# Altium schematic sheet MCU_Main.SchDoc
size A4; SheetNumber: 5
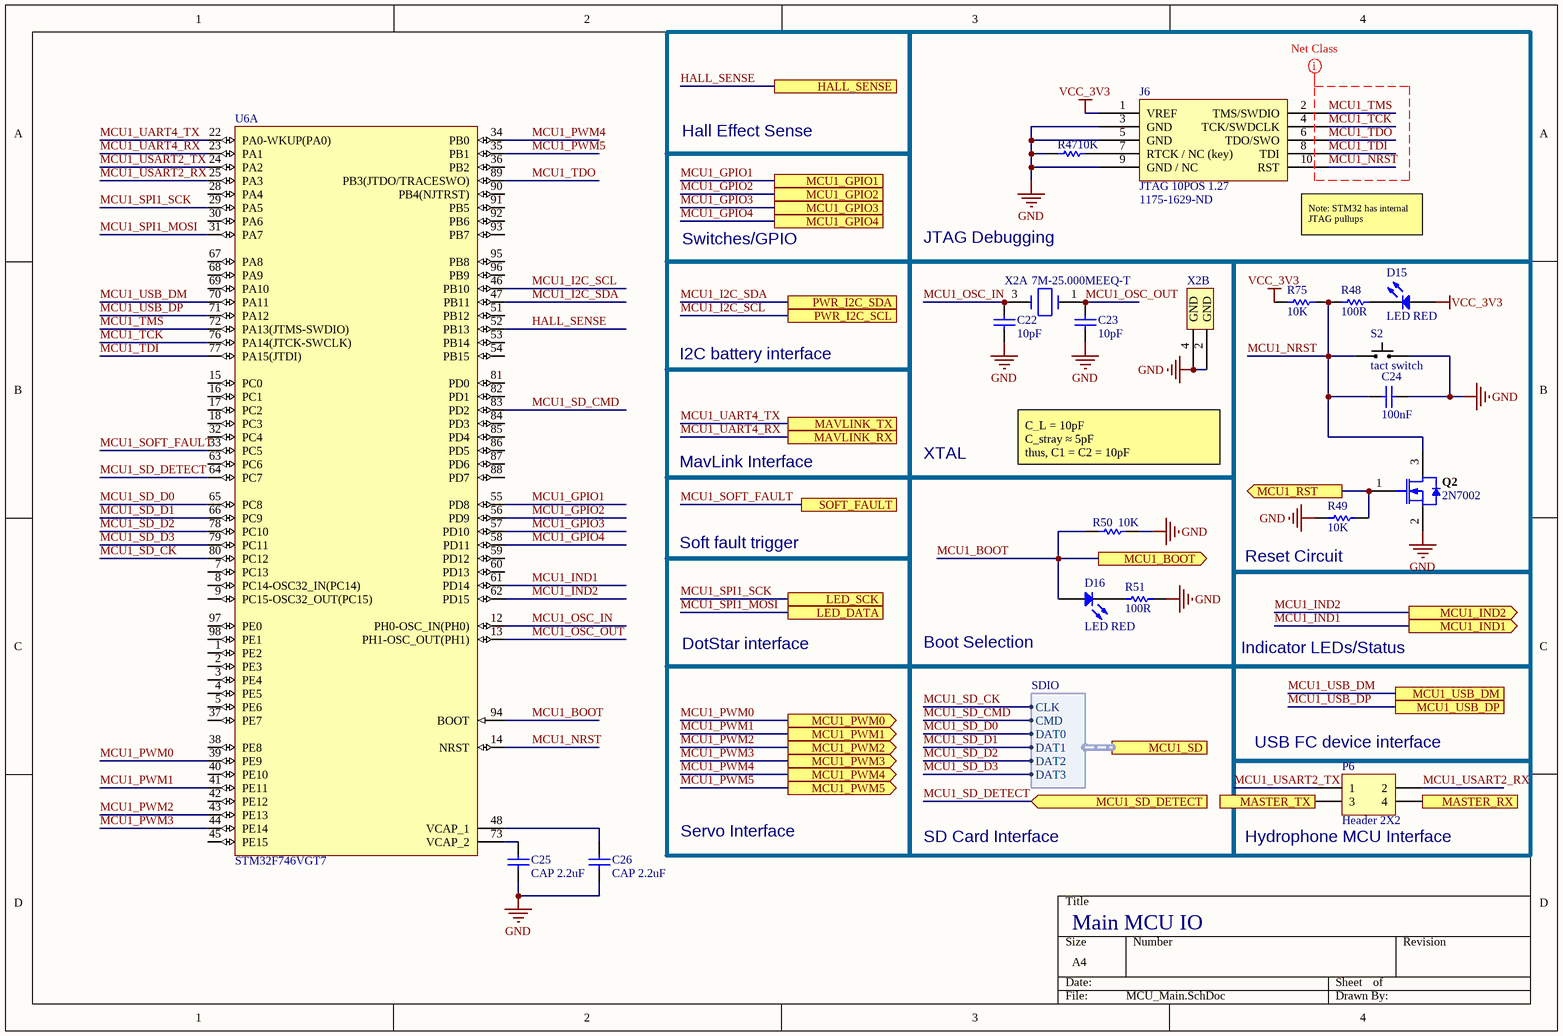
[diagram p0: MCU_Main.SchDoc]

## Parts
C22  10pF  [CAPC0603(1608)100_N]
C23  10pF  [CAPC0603(1608)100_N]
C24  100nF  [CAPC0603(1608)100_N]
C25  CAP 2.2uF  [CAPC0603(1608)100_N]
C26  CAP 2.2uF  [CAPC0603(1608)100_N]
D15  LED RED  [LED_0805]
D16  LED RED  [LED_0805]
J6  JTAG 10POS 1.27  Supplier Part Number 1: 1175-1629-ND  [5x2 JTAG SMD]
P6  Header 2X2  [HDR2X2]
Q2  2N7002  [INF-PG-SOT23_M]
R47  10K  [RESC0603(1608)_N]
R48  100R  [RESC0603(1608)_N]
R49  10K  [RESC0603(1608)_N]
R50  10K  [RESC0603(1608)_N]
R51  100R  [RESC0603(1608)_N]
R75  10K  [RESC0603(1608)_N]
S2  tact switch  [EVP-AA202K]
U6  STM32F746VGT7  [STM-LQFP100_L]  (part A of 2)
X2  7M-25.000MEEQ-T  [OSCSC320X250X100N]  (parts A,B of 2)

## Blocks framed on the sheet
JTAG Debugging: J6 R47
Reset Circuit: C24 D15 Q2 R48 R49 R75 S2

## Ports
HALL_SENSE, LED_DATA, LED_SCK, MASTER_RX, MASTER_TX, MAVLINK_RX, MAVLINK_TX, MCU1_BOOT (out), MCU1_GPIO1, MCU1_GPIO2, MCU1_GPIO3, MCU1_GPIO4, MCU1_IND1 (out), MCU1_IND2 (out), MCU1_PWM0 (out), MCU1_PWM1 (out), MCU1_PWM2 (out), MCU1_PWM3 (out), MCU1_PWM4 (out), MCU1_PWM5 (out), MCU1_RST (out), MCU1_SD (harness SDIO), MCU1_SD_DETECT (in), MCU1_USB_DM, MCU1_USB_DP, PWR_I2C_SCL, PWR_I2C_SDA, SOFT_FAULT

## Harnesses
SDIO: CLK, CMD, DAT0, DAT1, DAT2, DAT3

## Nets
GND: C22.1 C23.1 C24.1 C25.1 C26.1 J6.3(GND) J6.5(GND) J6.9(GND_/_NC) Q2.2(SOURCE) R47.1 R49.2 R50.2 R51.2 S2.2 X2.2(GND) X2.4(GND)
VCC_3V3: D15.2(A) J6.1(VREF) R75.2
HALL_SENSE: U6.52(PB13) ; port HALL_SENSE
MASTER_RX: P6.4 ; port MASTER_RX
MASTER_TX: P6.3 ; port MASTER_TX
MCU1_BOOT: D16.2(A) R50.1 U6.94(BOOT) ; port MCU1_BOOT
MCU1_GPIO1: U6.55(PD8) ; port MCU1_GPIO1
MCU1_GPIO2: U6.56(PD9) ; port MCU1_GPIO2
MCU1_GPIO3: U6.57(PD10) ; port MCU1_GPIO3
MCU1_GPIO4: U6.58(PD11) ; port MCU1_GPIO4
MCU1_I2C_SCL: U6.46(PB10) ; port PWR_I2C_SCL
MCU1_I2C_SDA: U6.47(PB11) ; port PWR_I2C_SDA
MCU1_IND1: U6.61(PD14) ; port MCU1_IND1
MCU1_IND2: U6.62(PD15) ; port MCU1_IND2
MCU1_NRST: C24.2 J6.10(RST) Q2.3(DRAIN) R48.2 R75.1 S2.1 U6.14(NRST)
MCU1_OSC_IN: C22.2 U6.12(PH0-OSC_IN(PH0)) X2.3
MCU1_OSC_OUT: C23.2 U6.13(PH1-OSC_OUT(PH1)) X2.1
MCU1_PWM0: U6.39(PE9) ; port MCU1_PWM0
MCU1_PWM1: U6.41(PE11) ; port MCU1_PWM1
MCU1_PWM2: U6.43(PE13) ; port MCU1_PWM2
MCU1_PWM3: U6.44(PE14) ; port MCU1_PWM3
MCU1_PWM4: U6.34(PB0) ; port MCU1_PWM4
MCU1_PWM5: U6.35(PB1) ; port MCU1_PWM5
MCU1_RST: Q2.1(GATE) R49.1 ; port MCU1_RST
MCU1_SD_CK: U6.80(PC12) ; port MCU1_SD.CLK
MCU1_SD_CMD: U6.83(PD2) ; port MCU1_SD.CMD
MCU1_SD_D0: U6.65(PC8) ; port MCU1_SD.DAT0
MCU1_SD_D1: U6.66(PC9) ; port MCU1_SD.DAT1
MCU1_SD_D2: U6.78(PC10) ; port MCU1_SD.DAT2
MCU1_SD_D3: U6.79(PC11) ; port MCU1_SD.DAT3
MCU1_SD_DETECT: U6.64(PC7) ; port MCU1_SD_DETECT
MCU1_SOFT_FAULT: U6.33(PC5) ; port SOFT_FAULT
MCU1_SPI1_MOSI: U6.31(PA7) ; port LED_DATA
MCU1_SPI1_SCK: U6.29(PA5) ; port LED_SCK
MCU1_TCK: J6.4(TCK/SWDCLK) U6.76(PA14(JTCK-SWCLK))
MCU1_TDI: J6.8(TDI) U6.77(PA15(JTDI))
MCU1_TDO: J6.6(TDO/SWO) U6.89(PB3(JTDO/TRACESWO))
MCU1_TMS: J6.2(TMS/SWDIO) U6.72(PA13(JTMS-SWDIO))
MCU1_UART4_RX: U6.23(PA1) ; port MAVLINK_RX
MCU1_UART4_TX: U6.22(PA0-WKUP(PA0)) ; port MAVLINK_TX
MCU1_USART2_RX: P6.2 U6.25(PA3)
MCU1_USART2_TX: P6.1 U6.24(PA2)
MCU1_USB_DM: U6.70(PA11) ; port MCU1_USB_DM
MCU1_USB_DP: U6.71(PA12) ; port MCU1_USB_DP
NetC25_2: C25.2 U6.73(VCAP_2)
NetC26_2: C26.2 U6.48(VCAP_1)
NetD15_1: D15.1(K) R48.1
NetD16_1: D16.1(K) R51.1
NetJ6_7: J6.7(RTCK_/_NC_(key)) R47.2

Not connected (* = marked no-connect by the designer): U6 1(PE2) 2(PE3) 3(PE4) 4(PE5) 5(PE6) 7(PC13) 8(PC14-OSC32_IN(PC14)) 9(PC15-OSC32_OUT(PC15)) 15(PC0) 16(PC1) 17(PC2) 18(PC3) 28(PA4) 30(PA6) 32(PC4) 36(PB2) 37(PE7) 38(PE8) 40(PE10) 42(PE12) 45(PE15) 51(PB12) 53(PB14) 54(PB15) 59(PD12) 60(PD13) 63(PC6) 67(PA8) 68(PA9) 69(PA10) 81(PD0) 82(PD1) 84(PD3) 85(PD4) 86(PD5) 87(PD6) 88(PD7) 90(PB4(NJTRST)) 91(PB5) 92(PB6) 93(PB7) 95(PB8) 96(PB9) 97(PE0) 98(PE1)

## Layout directives
net class JTAG: MCU1_NRST, MCU1_TCK, MCU1_TDI, MCU1_TDO, MCU1_TMS

## Notes on the sheet
- Hall Effect Sense
- Switches/GPIO
- (near J6) Note: STM32 has internal JTAG pullups
- I2C battery interface
- MavLink Interface
- XTAL
- C_L = 10pF
  C_stray ≈ 5pF
  thus, C1 = C2 = 10pF
- Soft fault trigger
- DotStar interface
- Boot Selection
- Indicator LEDs/Status
- (near P6) USB FC device interface
- Servo Interface
- SD Card Interface
- (near P6) Hydrophone MCU Interface
- Main MCU IO

## Library data of the parts
C22 C23 = CMP-1035-00549-1: CAP 10pF 25V ±1% 0603 (1608 Metric) Thickness 1mm SMD; Case-EIA: 0603; Case-Metric: 1608; Tolerance: Â±1%; Technology: SMT; Max Thickness: 1 mm; Value: 10pF; Rated Voltage: 25 V
C24 = CMP-1035-02580-1: CAP 100nF 10V ±10% 0603 (1608 Metric) Thickness 1mm SMD; Tolerance: Â±10%; Case-EIA: 0603; Case-Metric: 1608; Max Thickness: 1 mm; Value: 100nF; Rated Voltage: 10 V; Technology: SMT
C25 C26 = CMP-1035-02758-1: CAP 2.2uF 10V ±10% 0603 (1608 Metric) Thickness 1mm SMD; Case-EIA: 0603; Case-Metric: 1608; Tolerance: Â±10%; Rated Voltage: 10 V; Value: 2.2uF; Max Thickness: 1 mm; Technology: SMT
D15 D16 = LED0: led; Manufacturer: Lite-On Inc.; Manufacturer Part Number: LTST-C171KRKT; Lens Color: Colorless; Lens Transparency: Clear; Millicandela Rating: 54mcd; Lens Style/Size: Rectangle with Flat Top, 1.40mm x 1.25mm; Voltage - Forward (Vf) (Typ): 2V; Current - Test: 20mA; Viewing Angle: 130°; Wavelength - Dominant: 631nm; Wavelength - Peak: 639nm; Supplier 1: Digi-Key; Supplier Part Number 1: 160-1427-1-ND; RoHS: RoHS Compliant; Category: Optoelectronics; Stock 1: 260544; Pricing 1: 1=0.31, 10=0.225, 25=0.1656, 100=0.1183, 250=0.0804, 500=0.07096, 1000=0.05558 (USD); Packaging: Cut Tape (CT); Part Status: Active; Color: Red; Mounting Type: Surface Mount; Features: -; Package / Case: 0805 (2012 Metric); Size / Dimension: 2.00mm L x 1.25mm W; Height (Max): 0.80mm; ComponentLink1URL: http://optoelectronics.liteon.com/upload/download/DS22-2000-109/LTST-C171KRKT.pdf; ComponentLink1Description: http://optoelectronics.liteon.com/upload/download/DS22-2000-109/LTST-C171KRKT.pdf
J6 = jtag 10pos mini: Supplier 1: Digi-Key
P6 = Header 2X2: Header, 2-Pin, Dual row; LatestRevisionDate: 17-Jul-2002; LatestRevisionNote: Re-released for DXP Platform.; Publisher: Altium Limited
Q2 = CMP-1149-00026-1: N-Channel OptiMOS Small-Signal-Transistor, 60 V VDS, 0.3 A ID, -55 to 150 degC, PG-SOT23, Reel, Green; Manufacturer: Infineon; RDS (on) (max) (@4.5V): 4,000 mOhm; VDS (max): 60 V; IDpuls (max): 1.2Â A; QG: 0.4Â nC; RDS (on) (max): 3,000 mOhm; RthJA (max): 250 K/W; ID (max): 0.3Â A; VGS(th) (max): 2.5Â V; VGS(th) (min): 1.5Â V; Green: TRUE; Ptot (max): 0.5Â W; PackageDescription: 3-Pin Small Outline Transistor Package, 2.9 x 1.3 mm Body, 0.95 mm Pitch; Halogen-free: TRUE; ComponentLink2Description: Datasheet; ComponentLink1URL: http://www.infineon.com/; Packing: Reel; DatasheetVersion: Rev. 2.4; PartNumber: 2N7002; PackageReference: PG-SOT23; PackageVersion: Apr-08; ComponentLink3URL: http://www.infineon.com/dgdl/SOT23-Package_Overview.pdf?folderId=db3a30431936bc4b0119532290053c66&fileId=db3a30431936bc4b0119533468123c85; ComponentLink1Description: Manufacturer URL; Mounting Technology: Surface Mount; ComponentLink3Description: Package Specification; ComponentLink2URL: http://www.infineon.com/dgdl/2N7002_Rev2.4.pdf?folderId=db3a3043156fd573011622e10b5c1f67&fileId=db3a304319bc939a0119c2a9461e79e6
R47 R49 R50 R75 = CMP-1012-00098-1: 10K 0.1W 5% 0603 (1608 Metric)  SMD; Case-EIA: 0603; Value: 10000.00 Ohm; Case-Metric: 1608; Technology: SMT; Tolerance: 5 %; Power: 0.1 W
R48 R51 = CMP-1012-00050-1: 100R 0.1W 5% 0603 (1608 Metric)  SMD; Case-EIA: 0603; Value: 100.00 Ohm; Case-Metric: 1608; Tolerance: 5 %; Technology: SMT; Power: 0.1 W
S2 = EVP-AA Switch: EVP-AA Momentary Switch SPST-NO; Part Number: EVP-AA202K; Supplier 1: Digi-Key; Supplier Part Number 1: P13348SCT-ND; Datasheet: http://industrial.panasonic.com/lecs/www-data/pdf/ATK0000/ATK0000CE26.pdf
U6 = CMP-1572-00044-1: ARM Cortex-M4 32-bit MCU+FPU, 1024 KB Flash, 320 KB Internal RAM, 82 I/Os, 100-Pin LQFP, -40 to 105 degC, Tray; FLASH Size (Prog) (kB): 1024; Internal RAM Size (kB): 320; I/Os (High Current): 82; Core: ARM Cortex-M7; Operating Frequency(F) (Processor speed) (MHz): 216; D/A Converter: 2; Supply Voltage(Vcc) min (V): 1.7; ComponentLink2Description: Datasheet; Package Reference: LQFP100; ComponentLink1URL: http://www.st.com/; Mounting Technology: Surface Mount; DatasheetVersion: Rev. 2; Package Description: 100-Pin Low Profile Quad Flat Package, Body 14 x 14 mm, Pitch 0.5 mm; ComponentLink1Description: Manufacturer URL; ComponentLink2URL: http://www.st.com/st-web-ui/static/active/en/resource/technical/document/datasheet/DM00166116.pdf; Packing: Tray
X2 = 7M-25.000MEEQ-T: CRYSTAL 25.0000MHZ 10PF SMD; Manufacturer 1: TXC; Frequency: 25MHz; Frequency Tolerance: 10ppm; ESR (Equivalent Series Resistance): 60R; Supplier 1: Digi-Key; Supplier Part Number 1: 887-1326-1-ND; Manufacturer Part Number 1: 7M-25.000MEEQ-T; Stock 1: 17097; Pricing 1: 1=1.27, 10=1.209, 50=1.1812, 100=1.0125, 500=0.9844, 1000=0.8297 (USD); Mount: Surface Mount; Case/Package: SMD/SMT; Number of Pins: 4; Min Operating Temperature: -20°C; Max Operating Temperature: 70°C; Load Capacitance: 10pF; Packaging: Tape and Reel; Package Quantity: 3000; Tolerance: 10ppm; Frequency Stability: 10ppm; Termination: SMD/SMT; Length: 3.2mm; Height: 0.031inch; Width: 0.098inch; Depth: 2.5mm; REACH SVHC: No SVHC; ComponentLink1URL: https://datasheet.ciiva.com/26918/getdatasheetpartid-757227-26918816.pdf; ComponentLink1Description: https://datasheet.ciiva.com/26918/getdatasheetpartid-757227-26918816.pdf; ComponentLink2URL: https://datasheet.ciiva.com/856/7m-accuracy-856022.pdf; ComponentLink2Description: https://datasheet.ciiva.com/856/7m-accuracy-856022.pdf; ComponentLink3URL: https://datasheet.ciiva.com/22658/1794111-22658486.pdf; ComponentLink3Description: https://datasheet.ciiva.com/22658/1794111-22658486.pdf; ComponentLink4URL: https://datasheet.ciiva.com/856/7m-accuracy-856023.pdf; ComponentLink4Description: https://datasheet.ciiva.com/856/7m-accuracy-856023.pdf; ComponentLink5URL: https://datasheet.ciiva.com/856/7m-accuracy-856024.pdf; ComponentLink5Description: https://datasheet.ciiva.com/856/7m-accuracy-856024.pdf; ComponentLink6URL: https://datasheet.ciiva.com/4946/7m-11184-4946126.pdf; ComponentLink6Description: https://datasheet.ciiva.com/4946/7m-11184-4946126.pdf; ComponentLink7URL: https://datasheet.ciiva.com/28498/1794111-28498878.pdf; ComponentLink7Description: https://datasheet.ciiva.com/28498/1794111-28498878.pdf